# Altium schematic sheet top_level.SchDoc: Top Level
size A3; DrawnBy: Angus Macdonald; SheetNumber: 1; SheetTotal: 5
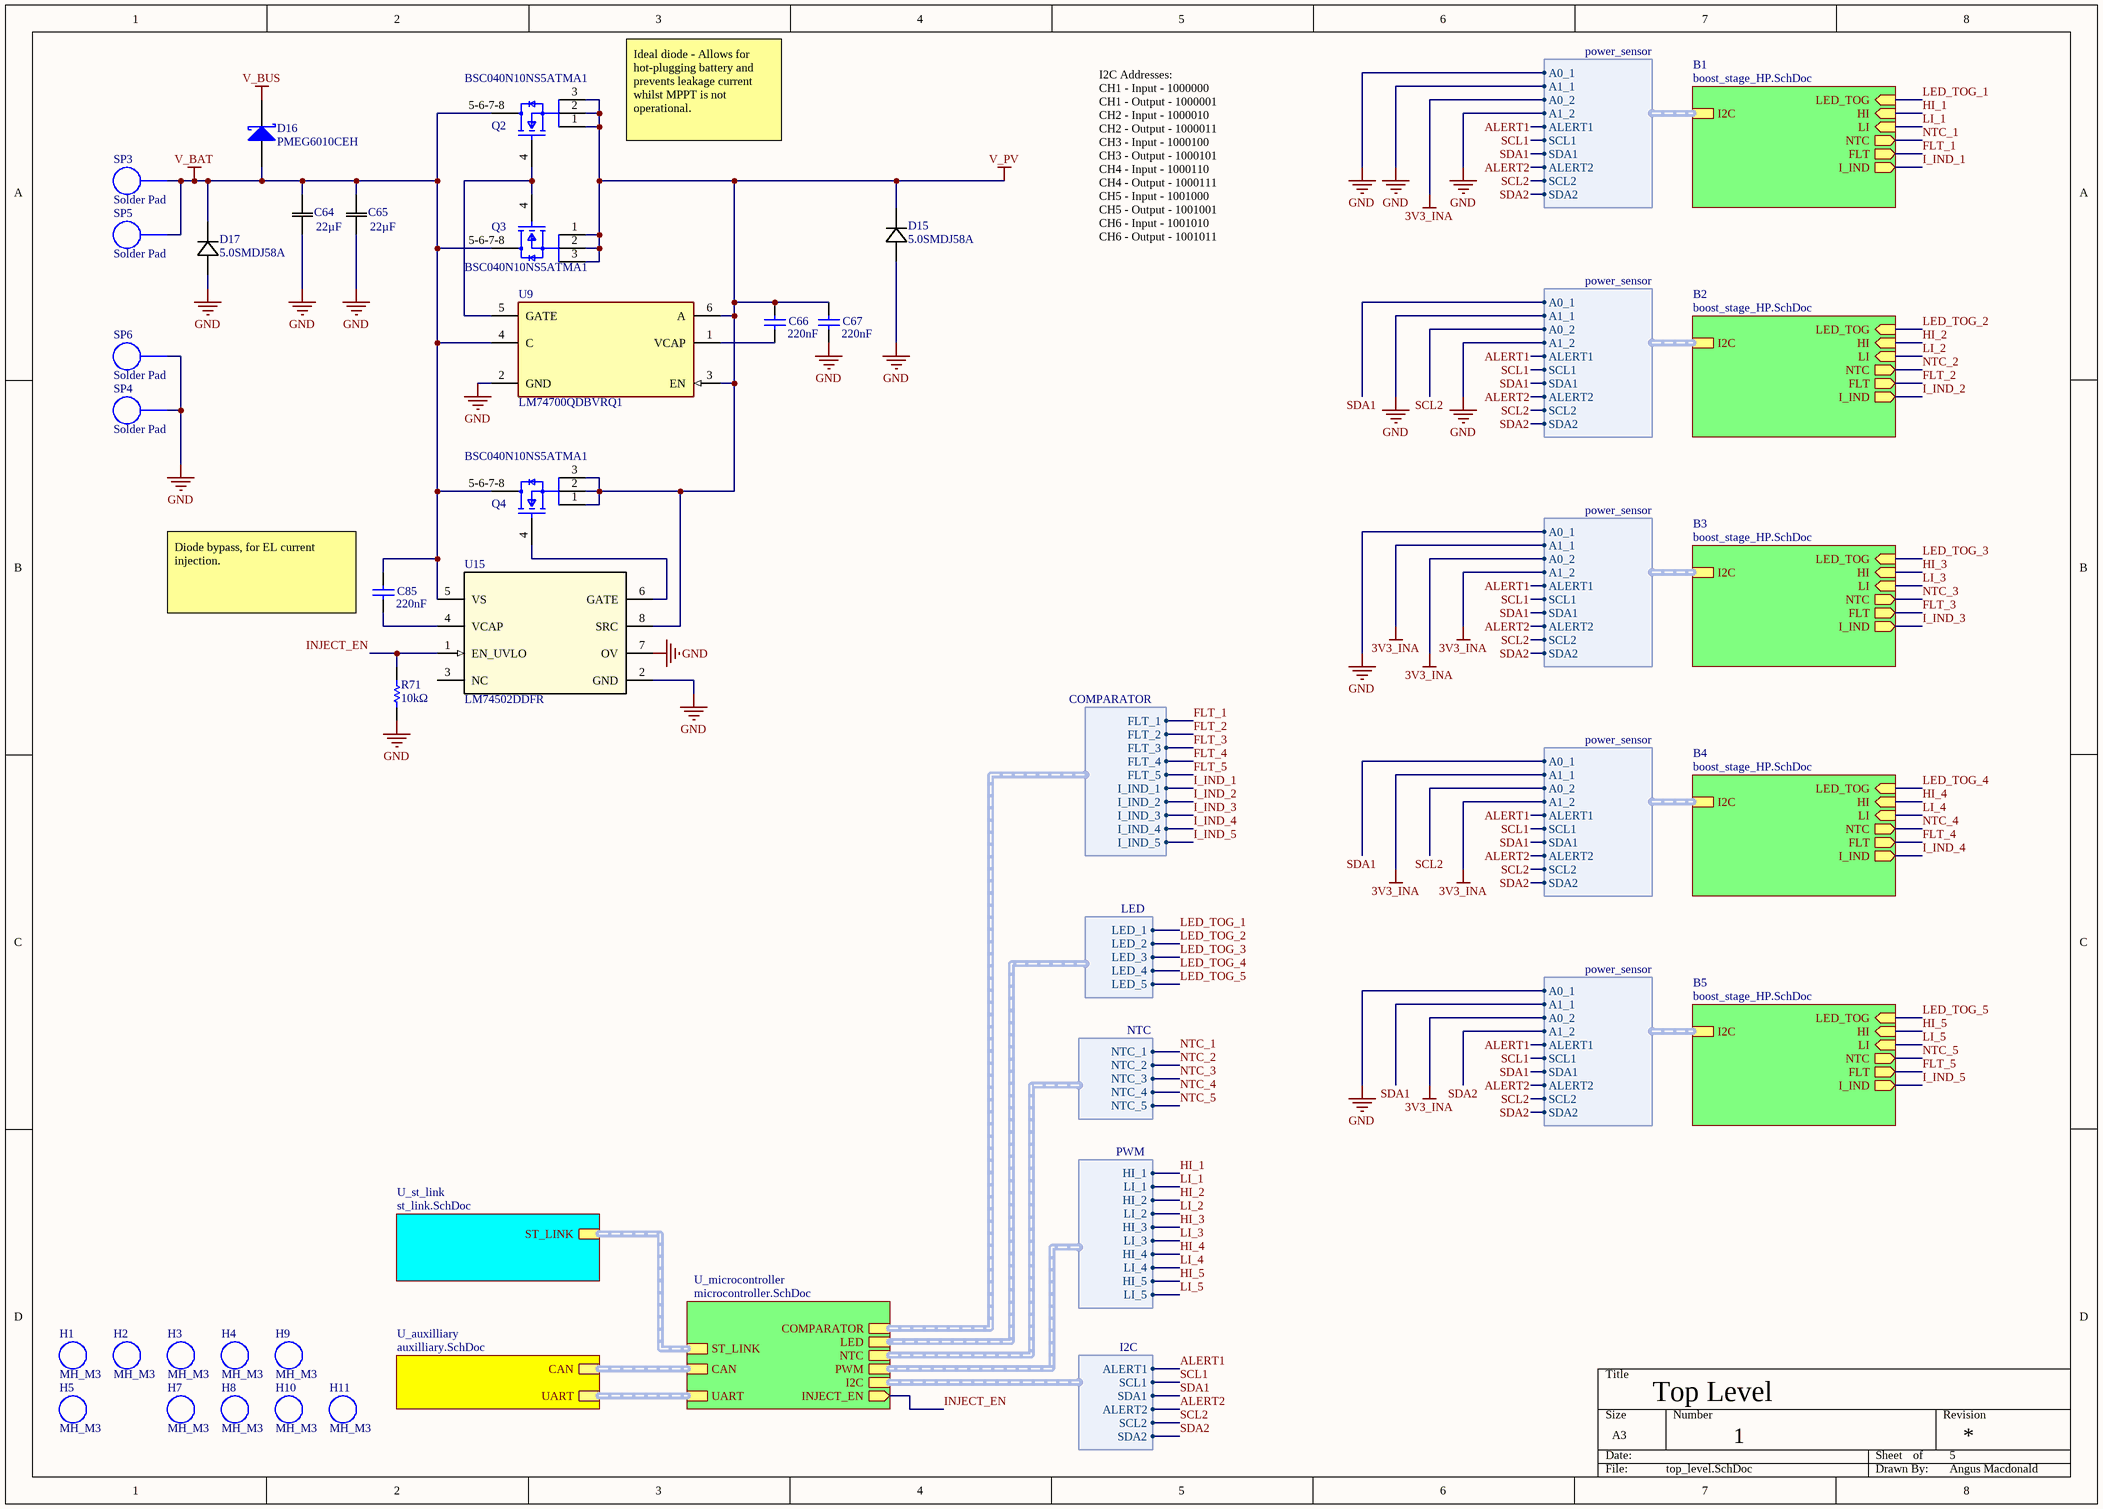
[diagram p0: top_level.SchDoc]

## Parts
C64  value 22µF  [CAP_EEE-FK2A220P_PAN]  (hidden comment: EEEFK2A220P)
C65  value 22µF  [CAP_EEE-FK2A220P_PAN]  (hidden comment: EEEFK2A220P)
C66  value 220nF  [C0805]  (hidden comment: CC0805KKX7R0BB224)
C67  value 220nF  [C0805]  (hidden comment: CC0805KKX7R0BB224)
C85  value 220nF  [C0805]  (hidden comment: CC0805KKX7R0BB224)
D15  5.0SMDJ58A  [5.0SMDJSeries_LTF]
D16  PMEG6010CEH  [FP-SOD123-IPC_A]
D17  5.0SMDJ58A  [5.0SMDJSeries_LTF]
H1  MH_M3  [MH_M3-Footprint-1]
H2  MH_M3  [MH_M3-Footprint-1]
H3  MH_M3  [MH_M3-Footprint-1]
H4  MH_M3  [MH_M3-Footprint-1]
H5  MH_M3  [MH_M3-Footprint-1]
H7  MH_M3  [MH_M3-Footprint-1]
H8  MH_M3  [MH_M3-Footprint-1]
H9  MH_M3  [MH_M3-Footprint-1]
H10  MH_M3  [MH_M3-Footprint-1]
H11  MH_M3  [MH_M3-Footprint-1]
Q2  BSC040N10NS5ATMA1  [FP-PG-TDSON-8-MFG]
Q3  BSC040N10NS5ATMA1  [FP-PG-TDSON-8-MFG]
Q4  BSC040N10NS5ATMA1  [FP-PG-TDSON-8-MFG]
R71  value 10kΩ  [RESC1608X55X25ML10T15]  (hidden comment: RC0603FR-0710KL)
SP3  Solder Pad  [Solder Pad-Footprint-1]
SP4  Solder Pad  [Solder Pad-Footprint-1]
SP5  Solder Pad  [Solder Pad-Footprint-1]
SP6  Solder Pad  [Solder Pad-Footprint-1]
U9  LM74700QDBVRQ1  [FP-DBV0006A-IPC_B]
U15  LM74502DDFR  [DDF0008A-IPC_A]

## Sub-sheets
B1 = boost_stage_HP.SchDoc: I2C (harness power_sensor), HI (in), LI (in), NTC (out), LED_TOG (in), FLT (out), I_IND (out)
B2 = boost_stage_HP.SchDoc: I2C (harness power_sensor), HI (in), LI (in), NTC (out), LED_TOG (in), FLT (out), I_IND (out)
B3 = boost_stage_HP.SchDoc: I2C (harness power_sensor), HI (in), LI (in), NTC (out), LED_TOG (in), FLT (out), I_IND (out)
B4 = boost_stage_HP.SchDoc: I2C (harness power_sensor), HI (in), LI (in), NTC (out), LED_TOG (in), FLT (out), I_IND (out)
B5 = boost_stage_HP.SchDoc: I2C (harness power_sensor), HI (in), LI (in), NTC (out), LED_TOG (in), FLT (out), I_IND (out)
U_auxilliary = auxilliary.SchDoc: CAN (harness CAN), UART (harness UART)
U_microcontroller = microcontroller.SchDoc: I2C (harness I2C), PWM (harness PWM), ST_LINK (harness ST_LINK), LED (harness LED), NTC (harness NTC), CAN (harness CAN), UART (harness UART), INJECT_EN (out), COMPARATOR (harness COMPARATOR)
U_st_link = st_link.SchDoc: ST_LINK (harness ST_LINK)

## Harnesses
power_sensor: A0_1, A1_1, A0_2, A1_2, ALERT1, SCL1, SDA1, ALERT2, SCL2, SDA2
PWM: HI_1, LI_1, HI_2, LI_2, HI_3, LI_3, HI_4, LI_4, HI_5, LI_5
I2C: ALERT1, SCL1, SDA1, ALERT2, SCL2, SDA2
NTC: NTC_1, NTC_2, NTC_3, NTC_4, NTC_5
LED: LED_1, LED_2, LED_3, LED_4, LED_5
COMPARATOR: FLT_1, FLT_2, FLT_3, FLT_4, FLT_5, I_IND_1, I_IND_2, I_IND_3, I_IND_4, I_IND_5

## Nets
3V3_INA: sheet B1/I2C.A0_2, sheet B3/I2C.A1_1, sheet B3/I2C.A0_2, sheet B3/I2C.A1_2, sheet B4/I2C.A1_1, sheet B4/I2C.A1_2, sheet B5/I2C.A0_2
GND: C64.1 C65.1 C67.1 D15.2 D17.2 R71.1 SP4.SP(Solder_Pad) SP6.SP(Solder_Pad) U9.2(GND) U15.2(GND) U15.7(OV) ; sheet B1/I2C.A0_1, sheet B1/I2C.A1_1, sheet B1/I2C.A1_2, sheet B2/I2C.A1_1, sheet B2/I2C.A1_2, sheet B3/I2C.A0_1, sheet B5/I2C.A0_1
V_BAT: C64.2 C65.2 C85.2 D16.2(A) D17.1 Q2.5-6-7-8(D) Q3.5-6-7-8(D) Q4.5-6-7-8(D) SP3.SP(Solder_Pad) SP5.SP(Solder_Pad) U9.4(C) U15.5(VS)
V_BUS: D16.1(K)
V_PV: C66.2 C67.2 D15.1 Q2.1(S) Q2.2(S) Q2.3(S) Q3.1(S) Q3.2(S) Q3.3(S) Q4.1(S) Q4.2(S) Q4.3(S) U9.3(EN) U9.6(A) U15.8(SRC)
ALERT1: sheet B1/I2C.ALERT1, sheet U_microcontroller/I2C.ALERT1, sheet B2/I2C.ALERT1, sheet B3/I2C.ALERT1, sheet B4/I2C.ALERT1, sheet B5/I2C.ALERT1
ALERT2: sheet B1/I2C.ALERT2, sheet U_microcontroller/I2C.ALERT2, sheet B2/I2C.ALERT2, sheet B3/I2C.ALERT2, sheet B4/I2C.ALERT2, sheet B5/I2C.ALERT2
FLT_1: sheet B1/FLT, sheet U_microcontroller/COMPARATOR.FLT_1
FLT_2: sheet B2/FLT, sheet U_microcontroller/COMPARATOR.FLT_2
FLT_3: sheet B3/FLT, sheet U_microcontroller/COMPARATOR.FLT_3
FLT_4: sheet B4/FLT, sheet U_microcontroller/COMPARATOR.FLT_4
FLT_5: sheet B5/FLT, sheet U_microcontroller/COMPARATOR.FLT_5
HI_1: sheet B1/HI, sheet U_microcontroller/PWM.HI_1
HI_2: sheet B2/HI, sheet U_microcontroller/PWM.HI_2
HI_3: sheet B3/HI, sheet U_microcontroller/PWM.HI_3
HI_4: sheet B4/HI, sheet U_microcontroller/PWM.HI_4
HI_5: sheet B5/HI, sheet U_microcontroller/PWM.HI_5
I_IND_1: sheet B1/I_IND, sheet U_microcontroller/COMPARATOR.I_IND_1
I_IND_2: sheet B2/I_IND, sheet U_microcontroller/COMPARATOR.I_IND_2
I_IND_3: sheet B3/I_IND, sheet U_microcontroller/COMPARATOR.I_IND_3
I_IND_4: sheet B4/I_IND, sheet U_microcontroller/COMPARATOR.I_IND_4
I_IND_5: sheet B5/I_IND, sheet U_microcontroller/COMPARATOR.I_IND_5
INJECT_EN: R71.2 U15.1(EN_UVLO) ; sheet U_microcontroller/INJECT_EN
LED_TOG_1: sheet B1/LED_TOG, sheet U_microcontroller/LED.LED_1
LED_TOG_2: sheet B2/LED_TOG, sheet U_microcontroller/LED.LED_2
LED_TOG_3: sheet B3/LED_TOG, sheet U_microcontroller/LED.LED_3
LED_TOG_4: sheet B4/LED_TOG, sheet U_microcontroller/LED.LED_4
LED_TOG_5: sheet B5/LED_TOG, sheet U_microcontroller/LED.LED_5
LI_1: sheet B1/LI, sheet U_microcontroller/PWM.LI_1
LI_2: sheet B2/LI, sheet U_microcontroller/PWM.LI_2
LI_3: sheet B3/LI, sheet U_microcontroller/PWM.LI_3
LI_4: sheet B4/LI, sheet U_microcontroller/PWM.LI_4
LI_5: sheet B5/LI, sheet U_microcontroller/PWM.LI_5
NTC_1: sheet B1/NTC, sheet U_microcontroller/NTC.NTC_1
NTC_2: sheet B2/NTC, sheet U_microcontroller/NTC.NTC_2
NTC_3: sheet B3/NTC, sheet U_microcontroller/NTC.NTC_3
NTC_4: sheet B4/NTC, sheet U_microcontroller/NTC.NTC_4
NTC_5: sheet B5/NTC, sheet U_microcontroller/NTC.NTC_5
SCL1: sheet B1/I2C.SCL1, sheet U_microcontroller/I2C.SCL1, sheet B2/I2C.SCL1, sheet B3/I2C.SCL1, sheet B4/I2C.SCL1, sheet B5/I2C.SCL1
SCL2: sheet B1/I2C.SCL2, sheet U_microcontroller/I2C.SCL2, sheet B2/I2C.A0_2, sheet B2/I2C.SCL2, sheet B3/I2C.SCL2, sheet B4/I2C.A0_2, sheet B4/I2C.SCL2, sheet B5/I2C.SCL2
SDA1: sheet B1/I2C.SDA1, sheet U_microcontroller/I2C.SDA1, sheet B2/I2C.A0_1, sheet B2/I2C.SDA1, sheet B3/I2C.SDA1, sheet B4/I2C.A0_1, sheet B4/I2C.SDA1, sheet B5/I2C.A1_1, sheet B5/I2C.SDA1
SDA2: sheet B1/I2C.SDA2, sheet U_microcontroller/I2C.SDA2, sheet B2/I2C.SDA2, sheet B3/I2C.SDA2, sheet B4/I2C.SDA2, sheet B5/I2C.A1_2, sheet B5/I2C.SDA2
NetC66_1: C66.1 U9.1(VCAP)
NetC85_1: C85.1 U15.4(VCAP)
NetQ2_4: Q2.4(G) Q3.4(G) U9.5(GATE)
NetQ4_4: Q4.4(G) U15.6(GATE)

Not connected (* = marked no-connect by the designer): U15 3(NC)

## Buses and harness runs
harness sheet U_auxilliary/CAN = sheet U_microcontroller/CAN
harness sheet U_auxilliary/UART = sheet U_microcontroller/UART
harness sheet U_microcontroller/ST_LINK = sheet U_st_link/ST_LINK

## Notes on the sheet
- Ideal diode - Allows for hot-plugging battery and prevents leakage current whilst MPPT is not operational.
- I2C Addresses:
  CH1 - Input - 1000000
  CH1 - Output - 1000001
  CH2 - Input - 1000010
  CH2 - Output - 1000011
  CH3 - Input - 1000100
  CH3 - Output - 1000101
  CH4 - Input - 1000110
  CH4 - Output - 1000111
  CH5 - Input - 1001000
  CH5 - Output - 1001001
  CH6 - Input - 1001010
  CH6 - Output - 1001011
- (near C85) Diode bypass, for EL current injection.

## Library data of the parts
C64 C65 = CMP-00270-3: Radial Can - SMD ALUMINUM ELECTROLYTIC CAPACITOR FK 100V 22muF ±20% 0.315Dia 8.00mm; Manufacturer Lifecycle Status: ACTIVE; Manufacturer_Name: Panasonic; Dissipation Factor: 7%; Impedance: 1.3Ω; Material: Aluminium; Ripple Current: 130mA; Polarity: Polar; Leakage Current: 22µA; Life (Hours): 2000hours; Lead Diameter: 900µm; Height - Seated (Max): 10.4902mm; Diameter: 8mm; Introduction Date: 2004-08-25; Pins: 2; Voltage Rating: 100V; Voltage Rating (DC): 100V; Case/Package: Radial; Number of Terminals: 2; Tolerance: 20%; REACH SVHC: Yes; Width: 8.3mm; Manufacturer_Part_Number: EEE-FK2A220P; Ratings: AEC-Q200; Max Operating Temperature: 105°C; Export Control Classification Number (ECCN) Code: EAR99; Source: EEE-FK2A220P.SchLib; Ripple Current (AC): 130mA; Min Operating Temperature: -55°C; RoHS: Compliant; Lifecycle Status: Production; Design Item ID: EEE-FK2A220P; Termination: SMD/SMT; Copyright: Copyright (C) 2025 Ultra Librarian. All rights reserved.; Country of Origin: Japan, Malaysia; Voltage: 100V; Part Series: FK; Harmonized Tariff Schedule (HTS) Code: 8532.22.00.20; Height: 10.2mm; Schedule B: 8532220020, 8532220020; Mounting Technology: Surface Mount; Lead Pitch: 3.1mm; Length: 10.2mm; Packaging: Cut Tape; Lead Free: Lead Free; ESR (Equivalent Series Resistance): 1.3Ω; Radiation Hardening: No
C66 C67 C85 = CMP-00180-1: Multilayer Ceramic Capacitors MLCC - SMD/SMT 100V 0.22uF X7R 0805 10%; Manufacturer Part Number: C2012X5R1A336M125AC; Positive Tolerance: 20%; Multilayer: Yes; Number of Terminals/Pins: 2; Capacitance: 33uF; Rated DC Voltage (URdc): 10V; Temperature Characteristics Code: X5R; RoHS Compliant: Yes; Package Style: SMTMeter; Schedule B: 8532240020, 8532240020; Dielectric: X7R; Termination: SMD/SMT; China RoHS: Compliant; Width: 1.25mm; Dielectric Material: Ceramic; Max Operating Temperature: 125°C; Mount: Surface Mount; Min Operating Temperature: -55°C; Tolerance: 10%; Weight: 5.499807mg; JESD-609 Code: e3; Thickness: 711.2µm; Length: 2mm; Case Code (Imperial): 0805; Package Shape: Rectangular; Negative Tolerance: 20%; REACH SVHC: Yes; Voltage Rating (DC): 100V; Case Code (Metric): 2012; Height: 1.25mm; Size Code: 0805; Mounting Technology: Surface Mount; Lifecycle Status: Production; Capacitor Type: Ceramic; Case/Package: 0805; Number of Terminals: 2; Packaging: Tape & Reel (TR); Voltage Rating: 100V; Composition: Ceramic; RoHS: Compliant; Terminal Finish: Nickel
D15 D17 = CMP-371-000000-3: Description; Manufacturer_Name: Littelfuse Inc; Copyright: Copyright (C) 2025 Ultra Librarian. All rights reserved.; Source: 5P0SMDJ58A.SchLib; Design Item ID: 5.0SMDJ58A; Manufacturer_Part_Number: 5.0SMDJ58A
D16 = CMP-002-000047-1: Rectifier Diode Schottky 1A Automotive 2-Pin SOD-123F / DIODE SCHOTTKY 60V 1A SOD123F; Element Configuration: Single; Number of Elements: 1; Peak Reverse Current: 50µA; Max Forward Surge Current (Ifsm): 9A; Max Power Dissipation: 375mW; Forward Voltage: 250mV; Lifecycle Status: Production; Export Control Classification Number (ECCN) Code: EAR99; Introduction Date: 2006-04-18; Contact Plating: Tin; Packaging: Cut Tape; China RoHS: Compliant; Termination: SMD/SMT; REACH SVHC: Yes; Min Operating Temperature: -65°C; Max Operating Temperature: 150°C; Country of Origin: Mainland China; Max Output current: 1A; Max Repetitive Reverse Voltage (Vrrm): 60V; Harmonized Tariff Schedule (HTS) Code: 8541.10.00.80; Pins: 2; Reverse Standoff Voltage: 60V; RoHS: Compliant; Number of Terminals: 2; Forward Current: 1A
H1-H5 H7-H11 = CMP-00278-2: Non-plated M3 Mounting hole.
Q2-Q4 = CMP-060-000024-2: On a Reel of 5000, N-Channel MOSFET, 100 A, 100 V, 8-Pin TDSON Infineon BSC040N10NS5ATMA1; Input Capacitance: 4.1nF; Max Dual Supply Voltage: 100V; Drain to Source Resistance: 4mΩ; Max Power Dissipation: 2.5W; Power Dissipation: 139W; Turn-On Delay Time: 13ns; Number of Elements: 1; Gate to Source Voltage (Vgs): 20V; Rise Time: 9ns; Max Junction Temperature (Tj): 150°C; Element Configuration: Single; Fall Time: 10ns; Continuous Drain Current (ID): 18A; Turn-Off Delay Time: 32ns; Lifecycle Status: Production; Packaging: Tape & Reel; Halogen Free: Halogen Free; Weight: 506.605978mg; Mounting Technology: Surface Mount; Max Operating Temperature: 150°C; Export Control Classification Number (ECCN) Code: EAR99; Height: 1.1mm; Number of Terminals: 5; Min Breakdown Voltage: 100V; On-State Resistance: 4mΩ; Contact Plating: Tin; Number of Channels: 1; China RoHS: Non-Compliant; Pins: 8; Introduction Date: 2015-01-07; Lead Free: Contains Lead; Drain to Source Breakdown Voltage: 100V; Drain to Source Voltage (Vdss): 100V; REACH SVHC: No; Package Quantity: 5000; RoHS: Compliant; Rds On Max: 4mΩ; Schedule B: 8541290080, 8541290080; Country of Origin: Austria, Germany, Mainland China, Malaysia; Min Operating Temperature: -55°C
R71 = CMP-RES-00040-1: 10 kOhms ±1% 0.1W, 1/10W Chip Resistor 0603 (1608 Metric) Moisture Resistant Thick Film; Tolerance: 1%; Case/Package: 0603
SP3-SP6 = CMP-014-000043-5: 64mm^2 solder pad for wire to board connections,
U9 = CMP-015-000057-1: 3.2-V to 65-V, 80-uA IQ automotive ideal diode controller 6-SOT-23 -40 to 125; Manufacturer Lifecycle Status: ACTIVE; Min Supply Voltage: 3.2V; Max Junction Temperature (Tj): 150°C; Nominal Supply Current: 80µA; Max Supply Voltage: 65V; Number of Outputs: 1; Width: 1.6mm; RoHS: Compliant; Length: 2.9mm; Schedule B: 8542390000; Height: 0m; Max Operating Temperature: 125°C; Lifecycle Status: Production; Pins: 6; Case/Package: SOT-23; Thickness: 1.2mm; Ambient Temperature Range High: 125°C; Min Operating Temperature: -40°C
U15 = CMP-050-000033-2: 3.2-V to 65-V industrial RPP controller with load disconnect and OVP 8-SOT-23-THIN -40 to 125; Manufacturer_Name: Texas Instruments; Source: LM74502DDFR.SchLib; RefDes: RefDes; TYPE: TYPE; Manufacturer_Part_Number: LM74502DDFR; Copyright: Copyright (C) 2026 Ultra Librarian. All rights reserved.; Design Item ID: LM74502DDFR